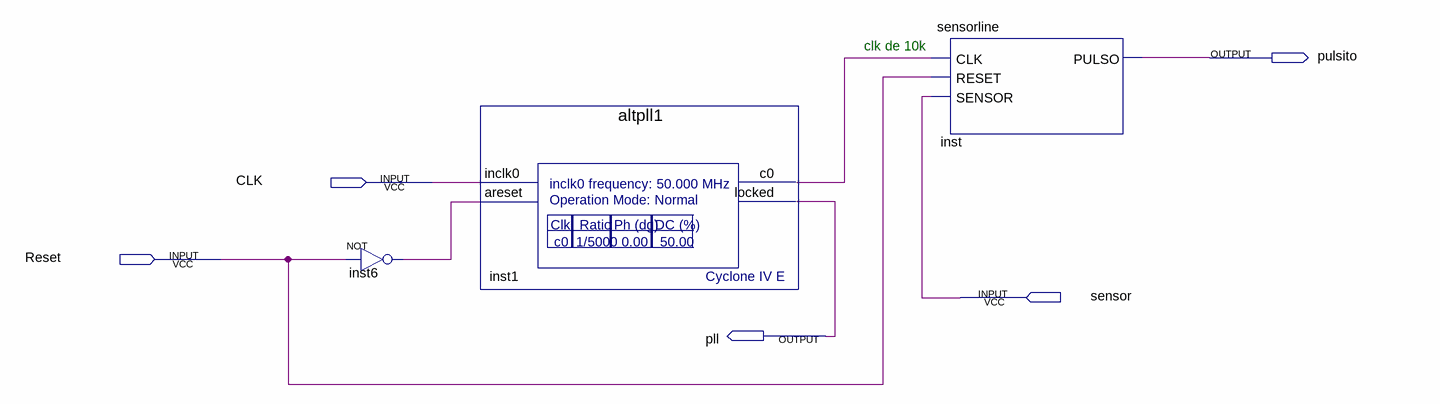
[diagram p0: schematic sheet]
// Quartus schematic sensorlinea.bdf as structural Verilog: 3 symbols, 5 pins
module sensorlinea (
  input  CLK,
  input  Reset,
  input  sensor,
  output pulsito,
  output pll
);

  wire inst1_c0, inst6_out;

  not inst6 (inst6_out, Reset);
  altpll1 inst1 (.inclk0(CLK), .areset(inst6_out), .c0(inst1_c0), .locked(pll));
  sensorline inst (.CLK(inst1_c0), .RESET(Reset), .SENSOR(sensor), .PULSO(pulsito));

  // Notes on the sheet:
  //   clk de 10k
endmodule
